# EAGLE schematic mWii (EAGLE 7.7.0)
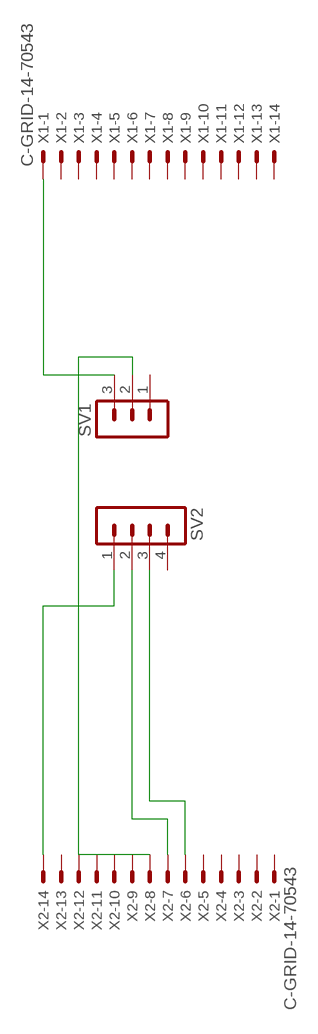
[diagram p0: schematic, sheet 1]

## Parts
SV1  MA03-1  [MA03-1]
SV2  MA04-1  [MA04-1]
X1  C-GRID-14-70543  [70543-14]
X2  C-GRID-14-70543  [70543-14]

## Nets
N$1: SV2.1 X2.14
N$2: SV1.3 X1.1
N$3: SV1.2 X2.8
N$4: SV2.2 X2.7
N$5: SV2.3 X2.6
Unconnected: SV1.1 SV2.4 X1.2 X1.3 X1.4 X1.5 X1.6 X1.7 X1.8 X1.9 X1.10 X1.11 X1.12 X1.13 X1.14 X2.1 X2.2 X2.3 X2.4 X2.5 X2.9 X2.10 X2.11 X2.12 X2.13

## Library data of the parts
SV1 = con-lstb:MA03-1: PIN HEADER; OC_FARNELL: unknown; OC_NEWARK: unknown
SV2 = con-lstb:MA04-1: PIN HEADER; OC_FARNELL: unknown; OC_NEWARK: unknown
X1 X2 = con-molex:C-GRID-14: CONNECTOR wire to board 2.54 mm (0.100") pitch header; OC_FARNELL: unknown; OC_NEWARK: unknown